# Altium project DCI_MB1137.PrjPCB
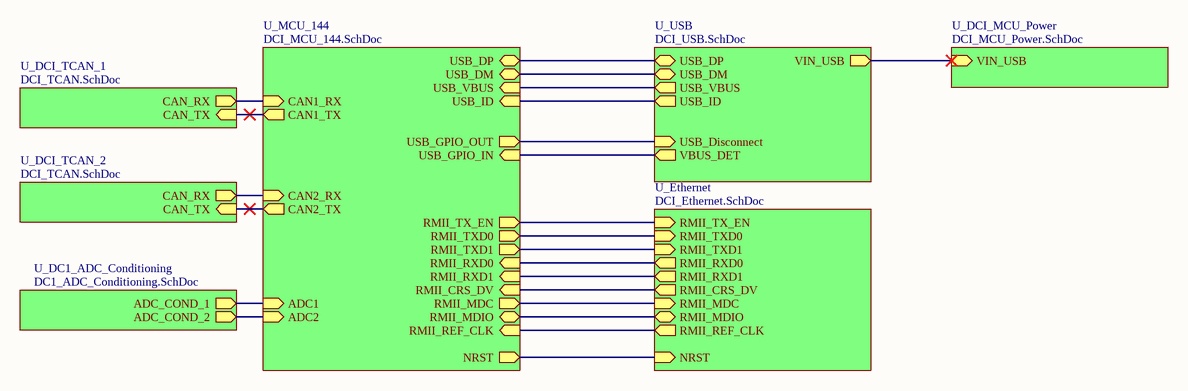
[diagram p0: DCI_MB1137.SchDoc]
7 sheets, 155 parts. Net scope: hierarchical (ports join the sheet entries above them; power ports are global).
Board file: DCI_MB1137.PcbDoc
Sheets:
  DCI_MB1137.SchDoc
    U_Ethernet = DCI_Ethernet.SchDoc
    U_MCU_144 = DCI_MCU_144.SchDoc
    U_USB = DCI_USB.SchDoc
    U_DCI_TCAN_2 = DCI_TCAN.SchDoc
    U_DC1_ADC_Conditioning = DC1_ADC_Conditioning.SchDoc
    U_DCI_MCU_Power = DCI_MCU_Power.SchDoc
    U_DCI_TCAN_1 = DCI_TCAN.SchDoc

## Sheet DCI_MB1137.SchDoc
size 420 x 297 mm; ENG_APP_DATE: --/--/--; DSN_APP_DATE: --/--/--; CHK_APP_DATE: --/--/--

### Sub-sheets
U_DC1_ADC_Conditioning = DC1_ADC_Conditioning.SchDoc: ADC_COND_1 (out), ADC_COND_2 (out)
U_DCI_MCU_Power = DCI_MCU_Power.SchDoc: VIN_USB (in)
U_DCI_TCAN_1 = DCI_TCAN.SchDoc: CAN_TX (in), CAN_RX (out)
U_DCI_TCAN_2 = DCI_TCAN.SchDoc: CAN_TX (in), CAN_RX (out)
U_Ethernet = DCI_Ethernet.SchDoc: RMII_TXD0 (in), RMII_TX_EN (in), RMII_RXD0 (out), RMII_REF_CLK (out), RMII_CRS_DV (out), RMII_MDC (in), RMII_MDIO (bidir), NRST (in), RMII_TXD1 (in), RMII_RXD1 (out)
U_MCU_144 = DCI_MCU_144.SchDoc: NRST (out), USB_DM (bidir), USB_DP (bidir), USB_GPIO_OUT (out), USB_GPIO_IN (in), USB_ID (in), USB_VBUS (in), RMII_TXD0 (out), RMII_TX_EN (out), RMII_RXD0 (in), RMII_REF_CLK (in), RMII_CRS_DV (in), RMII_MDC (out), RMII_MDIO (bidir), RMII_TXD1 (out), RMII_RXD1 (in), ADC1 (in), ADC2 (in), CAN1_RX (in), CAN1_TX (out), CAN2_TX (out), CAN2_RX (in)
U_USB = DCI_USB.SchDoc: USB_DM (bidir), USB_DP (bidir), USB_ID (out), USB_VBUS (out), USB_Disconnect (in), VBUS_DET (out), VIN_USB (out)

### Nets
NRST: sheet U_Ethernet/NRST, sheet U_MCU_144/NRST
PA1: sheet U_Ethernet/RMII_REF_CLK, sheet U_MCU_144/RMII_REF_CLK
PA2: sheet U_Ethernet/RMII_MDIO, sheet U_MCU_144/RMII_MDIO
PA7: sheet U_Ethernet/RMII_CRS_DV, sheet U_MCU_144/RMII_CRS_DV
PA10: sheet U_MCU_144/USB_ID, sheet U_USB/USB_ID
PB13: sheet U_Ethernet/RMII_TXD1, sheet U_MCU_144/RMII_TXD1
PC1: sheet U_Ethernet/RMII_MDC, sheet U_MCU_144/RMII_MDC
PC4: sheet U_Ethernet/RMII_RXD0, sheet U_MCU_144/RMII_RXD0
PC5: sheet U_Ethernet/RMII_RXD1, sheet U_MCU_144/RMII_RXD1
PC12: sheet U_MCU_144/CAN2_TX, sheet U_DCI_TCAN_2/CAN_TX
PD2: sheet U_MCU_144/CAN2_RX, sheet U_DCI_TCAN_2/CAN_RX
PF4: sheet U_MCU_144/ADC1, sheet U_DC1_ADC_Conditioning/ADC_COND_1
PF5: sheet U_MCU_144/ADC2, sheet U_DC1_ADC_Conditioning/ADC_COND_2
PF6: sheet U_MCU_144/CAN1_RX, sheet U_DCI_TCAN_1/CAN_RX
PF7: sheet U_MCU_144/CAN1_TX, sheet U_DCI_TCAN_1/CAN_TX
PG6: sheet U_MCU_144/USB_GPIO_OUT, sheet U_USB/USB_Disconnect
PG7: sheet U_MCU_144/USB_GPIO_IN, sheet U_USB/VBUS_DET
PG11: sheet U_Ethernet/RMII_TX_EN, sheet U_MCU_144/RMII_TX_EN
PG13: sheet U_Ethernet/RMII_TXD0, sheet U_MCU_144/RMII_TXD0
USB_D_N: sheet U_MCU_144/USB_DM, sheet U_USB/USB_DM
USB_D_P: sheet U_MCU_144/USB_DP, sheet U_USB/USB_DP
VIN_USB: sheet U_MCU_144/USB_VBUS, sheet U_USB/USB_VBUS, sheet U_USB/VIN_USB, sheet U_DCI_MCU_Power/VIN_USB

### Notes on the sheet
- MEMBERS:
- Universitat Politècnica de València
- - Gianmarco Leopoldo Sangoi
- - Vicente Beltrán Morte
- PROJECT:
- SIZE:
- FILE NAME:
- A3
- NUMBER:
- 1
- REVISION:
- A1
- DATE:
- 07/05/2022
- SHEET
- OF
- 7

## Sheet DCI_Ethernet.SchDoc
size 420 x 297 mm; ENG_APP_DATE: --/--/--; DSN_APP_DATE: --/--/--; CHK_APP_DATE: --/--/--
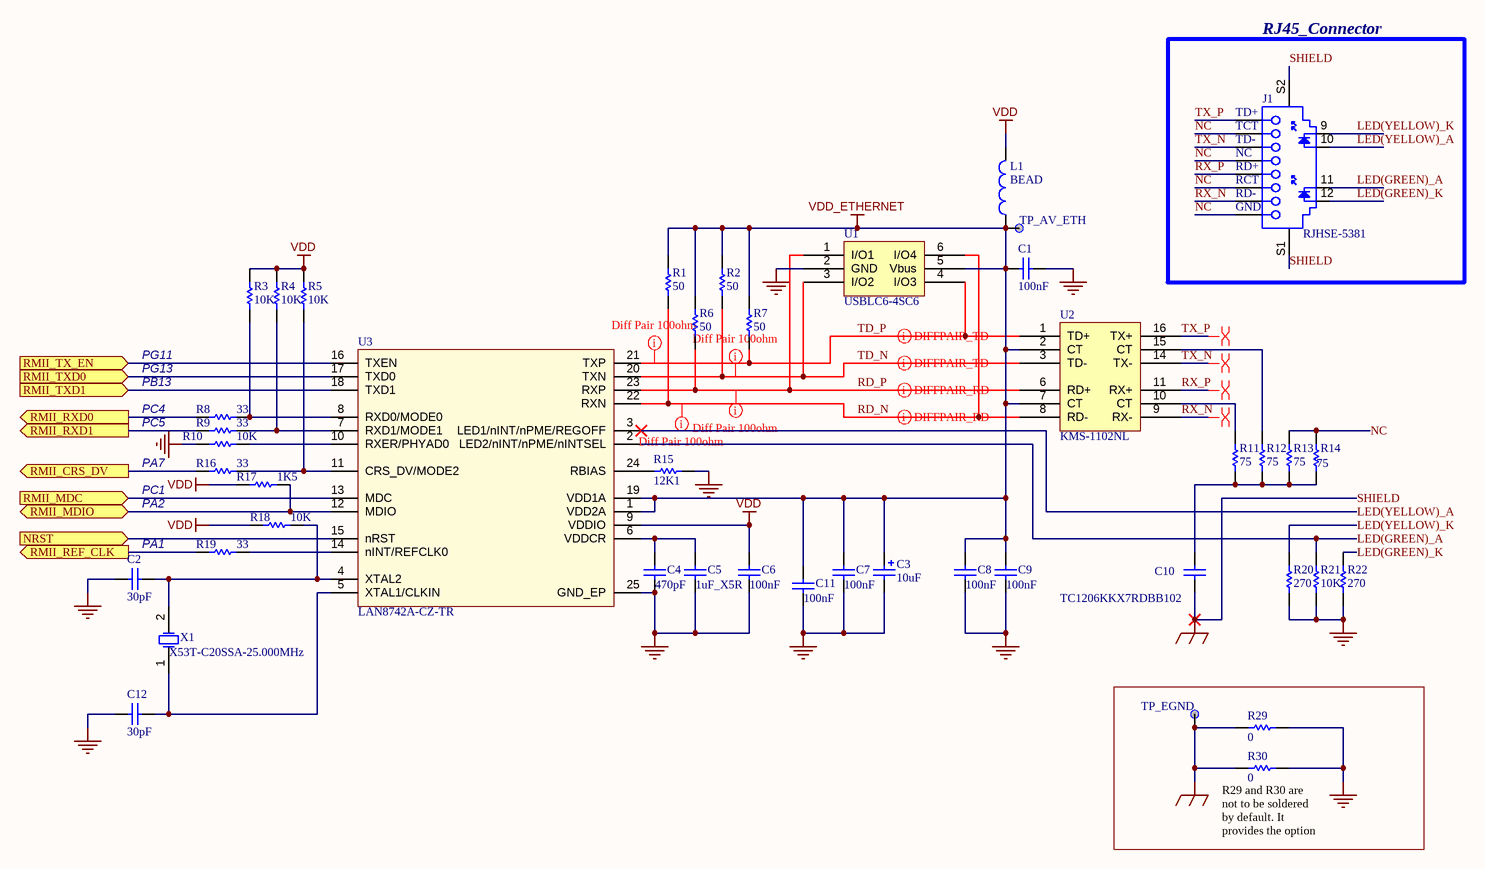
[diagram p1: DCI_Ethernet.SchDoc]

### Parts
C1  100nF  [0603C]
C2  30pF  [0603C]
C3  10uF  [TAN-A - XDown]
C4  470pF  [0603C]
C5  1uF_X5R  [0603C]
C6  100nF  [0603C]
C7  100nF  [0603C]
C8  100nF  [0603C]
C9  100nF  [0603C]
C10  TC1206KKX7RDBB102  [1206C]
C11  100nF  [0603C]
C12  30pF  [0603C]
J1  RJHSE-5381  [AMPH-RJHSE-5381_V]
L1  BEAD  [0603L]
R1  50  [0603R]
R2  50  [0603R]
R3  10K  [0603R]
R4  10K  [0603R]
R5  10K  [0603R]
R6  50  [0603R]
R7  50  [0603R]
R8  33  [0603R]
R9  33  [0603R]
R10  10K  [0603R]
R11  75  [0603R]
R12  75  [0603R]
R13  75  [0603R]
R14  75  [0603R]
R15  12K1  [0603R]
R16  33  [0603R]
R17  1K5  [0603R]
R18  10K  [0603R]
R19  33  [0603R]
R20  270  [0603R]
R21  10K  [0603R]
R22  270  [0603R]
R29  0  [0603R]
R30  0  [0603R]
TP_AV_ETH  TP_AVDD_ETH  [TP]  (value not drawn)
TP_EGND  TP_EGND  [TP]  (value not drawn)
U1  USBLC6-4SC6  [SOT23-6L]
U2  KMS-1102NL  [Transformer]
U3  LAN8742A-CZ-TR  [QFN24_0R5_4X4]
X1  X53T-C20SSA-25.000MHz  [XTAL_2SM_5R0X3R2]

### Blocks framed on the sheet
RJ45_Connector: J1

### Ports
NRST (in), RMII_CRS_DV (out), RMII_MDC (in), RMII_MDIO (bidir), RMII_REF_CLK (out), RMII_RXD0 (out), RMII_RXD1 (out), RMII_TX_EN (in), RMII_TXD0 (in), RMII_TXD1 (in)

### Nets
GND: C1.1 C2.2 C3.2 C4.1 C5.2 C6.1 C7.1 C8.1 C9.1 C11.1 C12.2 R10.2 R15.2 R20.2 R21.2 R22.2 R29.1 R30.1 U1.2(GND) U3.25(GND_EP)
SHIELD: C10.1 J1.S1 J1.S2 R29.2 R30.2 TP_EGND.1  [also labelled EGND]
VDD: C6.2 L1.2 R3.1 R4.1 R5.1 R17.2 R18.1 U3.9(VDDIO)
VDD_ETHERNET: C1.2 C3.1 C7.2 C8.2 C9.2 C11.2 L1.1 R1.2 R2.2 R6.2 R7.2 TP_AV_ETH.1 U1.5(Vbus) U2.2(CT) U2.7(CT) U3.1(VDD2A) U3.19(VDD1A)
LED(GREEN)_A: J1.11 R21.1 U3.2(LED2/nINT/nPME/nINTSEL)
LED(GREEN)_K: J1.12 R22.1
LED(YELLOW)_A: J1.10 U3.3(LED1/nINT/nPME/REGOFF)
LED(YELLOW)_K: J1.9 R20.1
NC: J1.2(TCT) J1.4(NC) J1.6(RCT) J1.8(GND) R13.2 R14.2
NRST: U3.15(nRST) ; port NRST
PA1: R19.2 ; port RMII_REF_CLK
PA2: R17.1 U3.12(MDIO) ; port RMII_MDIO
PA7: R16.2 ; port RMII_CRS_DV
PB13: U3.18(TXD1) ; port RMII_TXD1
PC1: U3.13(MDC) ; port RMII_MDC
PC4: R8.2 ; port RMII_RXD0
PC5: R9.2 ; port RMII_RXD1
PG11: U3.16(TXEN) ; port RMII_TX_EN
PG13: U3.17(TXD0) ; port RMII_TXD0
RD_N: R1.1 U1.6(I/O4) U2.8(RD-) U3.22(RXN)
RD_P: R6.1 U1.1(I/O1) U2.6(RD+) U3.23(RXP)
RX_N: J1.7(RD-) U2.9(RX-)
RX_P: J1.5(RD+) U2.11(RX+)
TD_N: R2.1 U1.3(I/O2) U2.3(TD-) U3.20(TXN)
TD_P: R7.1 U1.4(I/O3) U2.1(TD+) U3.21(TXP)
TX_N: J1.3(TD-) U2.14(TX-)
TX_P: J1.1(TD+) U2.16(TX+)
NetC2_1: C2.1 R18.2 U3.4(XTAL2) X1.2(OSC2)
NetC4_2: C4.2 C5.1 U3.6(VDDCR)
NetC10_2: C10.2 R11.1 R12.1 R13.1 R14.1
NetC12_1: C12.1 U3.5(XTAL1/CLKIN) X1.1(OSC1)
NetR3_2: R3.2 R8.1 U3.8(RXD0/MODE0)
NetR4_2: R4.2 R9.1 U3.7(RXD1/MODE1)
NetR5_2: R5.2 R16.1 U3.11(CRS_DV/MODE2)
NetR10_1: R10.1 U3.10(RXER/PHYAD0)
NetR11_2: R11.2 U2.10(CT)
NetR12_2: R12.2 U2.15(CT)
NetR15_1: R15.1 U3.24(RBIAS)
NetR19_1: R19.1 U3.14(nINT/REFCLK0)

### Layout directives
differential pair: RD_N, RD_P, RX_N, RX_P, TD_N, TD_P, TX_N, TX_P
rule Matched Net Lengths [Tolerance = 100mil]: RD_N, RD_P, TD_N, TD_P

### Notes on the sheet
- PG11
- PG13
- PB13
- PC4
- PC5
- PA7
- PC1
- PA2
- (near C2) PA1
- (near R30) R29 and R30 are not to be soldered by default. It provides the option of it being present to the final user. Therefore, only the footprint will be present in the final assembly
- MEMBERS:
- Universitat Politècnica de València
- - Gianmarco Leopoldo Sangoi
- - Vicente Beltrán Morte
- PROJECT:
- SIZE:
- FILE NAME:
- A3
- NUMBER:
- 4
- REVISION:
- A1
- DATE:
- 07/05/2022
- SHEET
- OF
- 7

### Library data of the parts
C1 C6-C9 C11 = Capacitor_ST: Capacitor 0402 / 0603 / 0805; Revision: July-2002: Re-released for DXP Platform.; Value: 100nF
C2 C4 C12 = Capacitor_ST: Capacitor 0402 / 0603 / 0805; Value: 100nF; Revision: July-2002: Re-released for DXP Platform.
C3 = Cap_10uF_POL_10%_TANA: Polarized Capacitor,10uF,10V,10%,typeA,VISHAY; Manuf_Part_1: 293D106X9010A2TE3; Revision: July-2002: Re-released for DXP Platform.; Value: 10uF; Manuf_1: VISHAY; Order: *; ECCN_US/EU: n/a
C5 = CAP SMD 0603  X5R 1µF 25V 10%: 0603  X5R 1µF; Rated voltage: 25V; Tolerance: 10%; Manufacturer: *; Manufacturer P/N: *; Order code Farnell: 1288202RL; Value: 1µF; Power: *; Technology: X5R; Temperature  Factor: *; Temperature Max: +125°C; Temperature Min: -55°C; STS Code: *
C10 = Capacitor_ST: Capacitor 0402 / 0603 / 0805/ 1206; Value: 100nF; Revision: July-2002: Re-released for DXP Platform.
J1 = CMP-2000-06980-1: High Speed RJ45, Modular Jack, 8 Position, 8 Contacts, Shielded, with LEDs, -55 to 85 degC,12-Pin THD, RoHS, Tray; Manufacturer: Amphenol; Number of Positions/Contacts: 8p8c(RJ45,Ethernet); Number of Ports: 1; Catalog Drawings: RJ45SeriesRightAngle; PCN Design/Specification: MultipleSeriesCopper29/Jan/2009RJHSEShieldMaterial30/Jun/2015; Other Names: RJHSE5381; Online Catalog: RJHSESeries; Featured Product: ModularJacksProductSolutions; Tab Direction: Up; Shielding: Shielded,EMIFinger; LED Color: Yellow-Green; 3D Model: RJHSE538x.stpRJHSE538x.igs; Category: Connectors,Interconnects; Termination: Solder; Housing Material: Thermoplastic; Mounting Type: ThroughHole; Family: ModularConnectors-Jacks; Orientation: 90°Angle(Right); Features: BoardLock; Contact Material: PhosphorBronze; Mounting Technology: ThroughHole; Number of Rows: 1; Standard Package: 120; Ratings: -; Operating Temperature: -55°C~85°C; Series: RJHSE; Contact Finish: Gold; Package Reference: RJHSE-5381; Ingress Protection: -; Package Description: 12-Pin Through Hole Device, Body 16.51 x 15.75 mm; Contact Finish Thickness: 50µin(1.27µm); Datasheet URL: https://datasheet.ciiva.com/16481/rjhse538x-16481714.pdf; Datasheet Version: Rev. K, 04/2014; Connector Type: Jack; Manufacturer URL: http://www.amphenol.com/; Packaging: Tray
L1 = Inductor: Value: 100uH; Published: 8-Jun-2000; Revision: July-2002: Re-released for DXP Platform.; Publisher: Altium Limited
R1 R2 R6 R7 = Res_50_1%_0603: Resistor,50,0603,1%,YAGEO; Manuf_Part_1: RC0402FR-0750RL; Value: 50; Manuf_1: YAGEO; Order: *; ECCN_US/EU: n/a; Distrib: FARNELL
R3-R5 R10 R18 R21 = Resistor_ST: Resistor 0402 / 0603 / 0805; Value: 10K
R8 R9 R16 R19 = Res_33_1%_0402: Resistor,33,0402,1%,YAGEO; Manuf_Part_1: RC0402FR-0733RL; Value: 33; Manuf_1: YAGEO; Order: *; ECCN_US/EU: n/a; Distrib: FARNELL
R11-R14 = Res_75_1%_0603: Resistor,75,0603,1%,YAGEO; Manuf_Part_1: RC0402FR-0750RL; Value: 50; Manuf_1: YAGEO; Order: *; ECCN_US/EU: n/a; Distrib: FARNELL
R15 = Res_12K1_1%_0603: Resistor,12K1,0603,1%,VISHAY; Manuf_Part_1: MCT 0603-50 1% P5 12K1; Order: 2325243; Value: 12K1; ECCN_US/EU: n/a; Manuf_1: VISHAY; Distrib: FARNELL
R17 = Res_1K5_1%_0402: Resistor,1K5,0402,1%,YAGEO; Manuf_Part_1: RC0402FR-071K5L; Value: 1K5; Manuf_1: YAGEO; Order: RC0402FR-071K5L; ECCN_US/EU: n/a; Distrib: FARNELL
R20 R22 = Resistor_ST: Resistor 0402 / 0603 / 0805; Value: 10K
R29 R30 = Res1: Resistor; Value: 1K; Ordered by: Subcon; Published: 8-Jun-2000; Revision: July-2002: Re-released for DXP Platform.; Publisher: Altium Limited
TP_AV_ETH TP_EGND = TP
U3 = LAN8742A-CZ-TR: LAN8742A-CZ-TR - Small Footprint RMII 10/100 Ethernet, Transceiver with HP Auto-MDIX and flexPWR Technology SQFN-24; Manuf_1: MICROCHIP; Order: LAN8742A-CZ-TR; Manuf_Part_1: LAN8742A-CZ-TR; Distrib: MICROCHIP
X1 = XTAL_5032: Crystal Oscillator; Published: 8-Jun-2000; LatestRevisionDate: 17-Jul-2002; LatestRevisionNote: Re-released for DXP Platform.; PackageReference: R38; Publisher: Altium Limited

## Sheet DCI_MCU_144.SchDoc
size 420 x 297 mm; Project: NUCLEO-XXXXZX
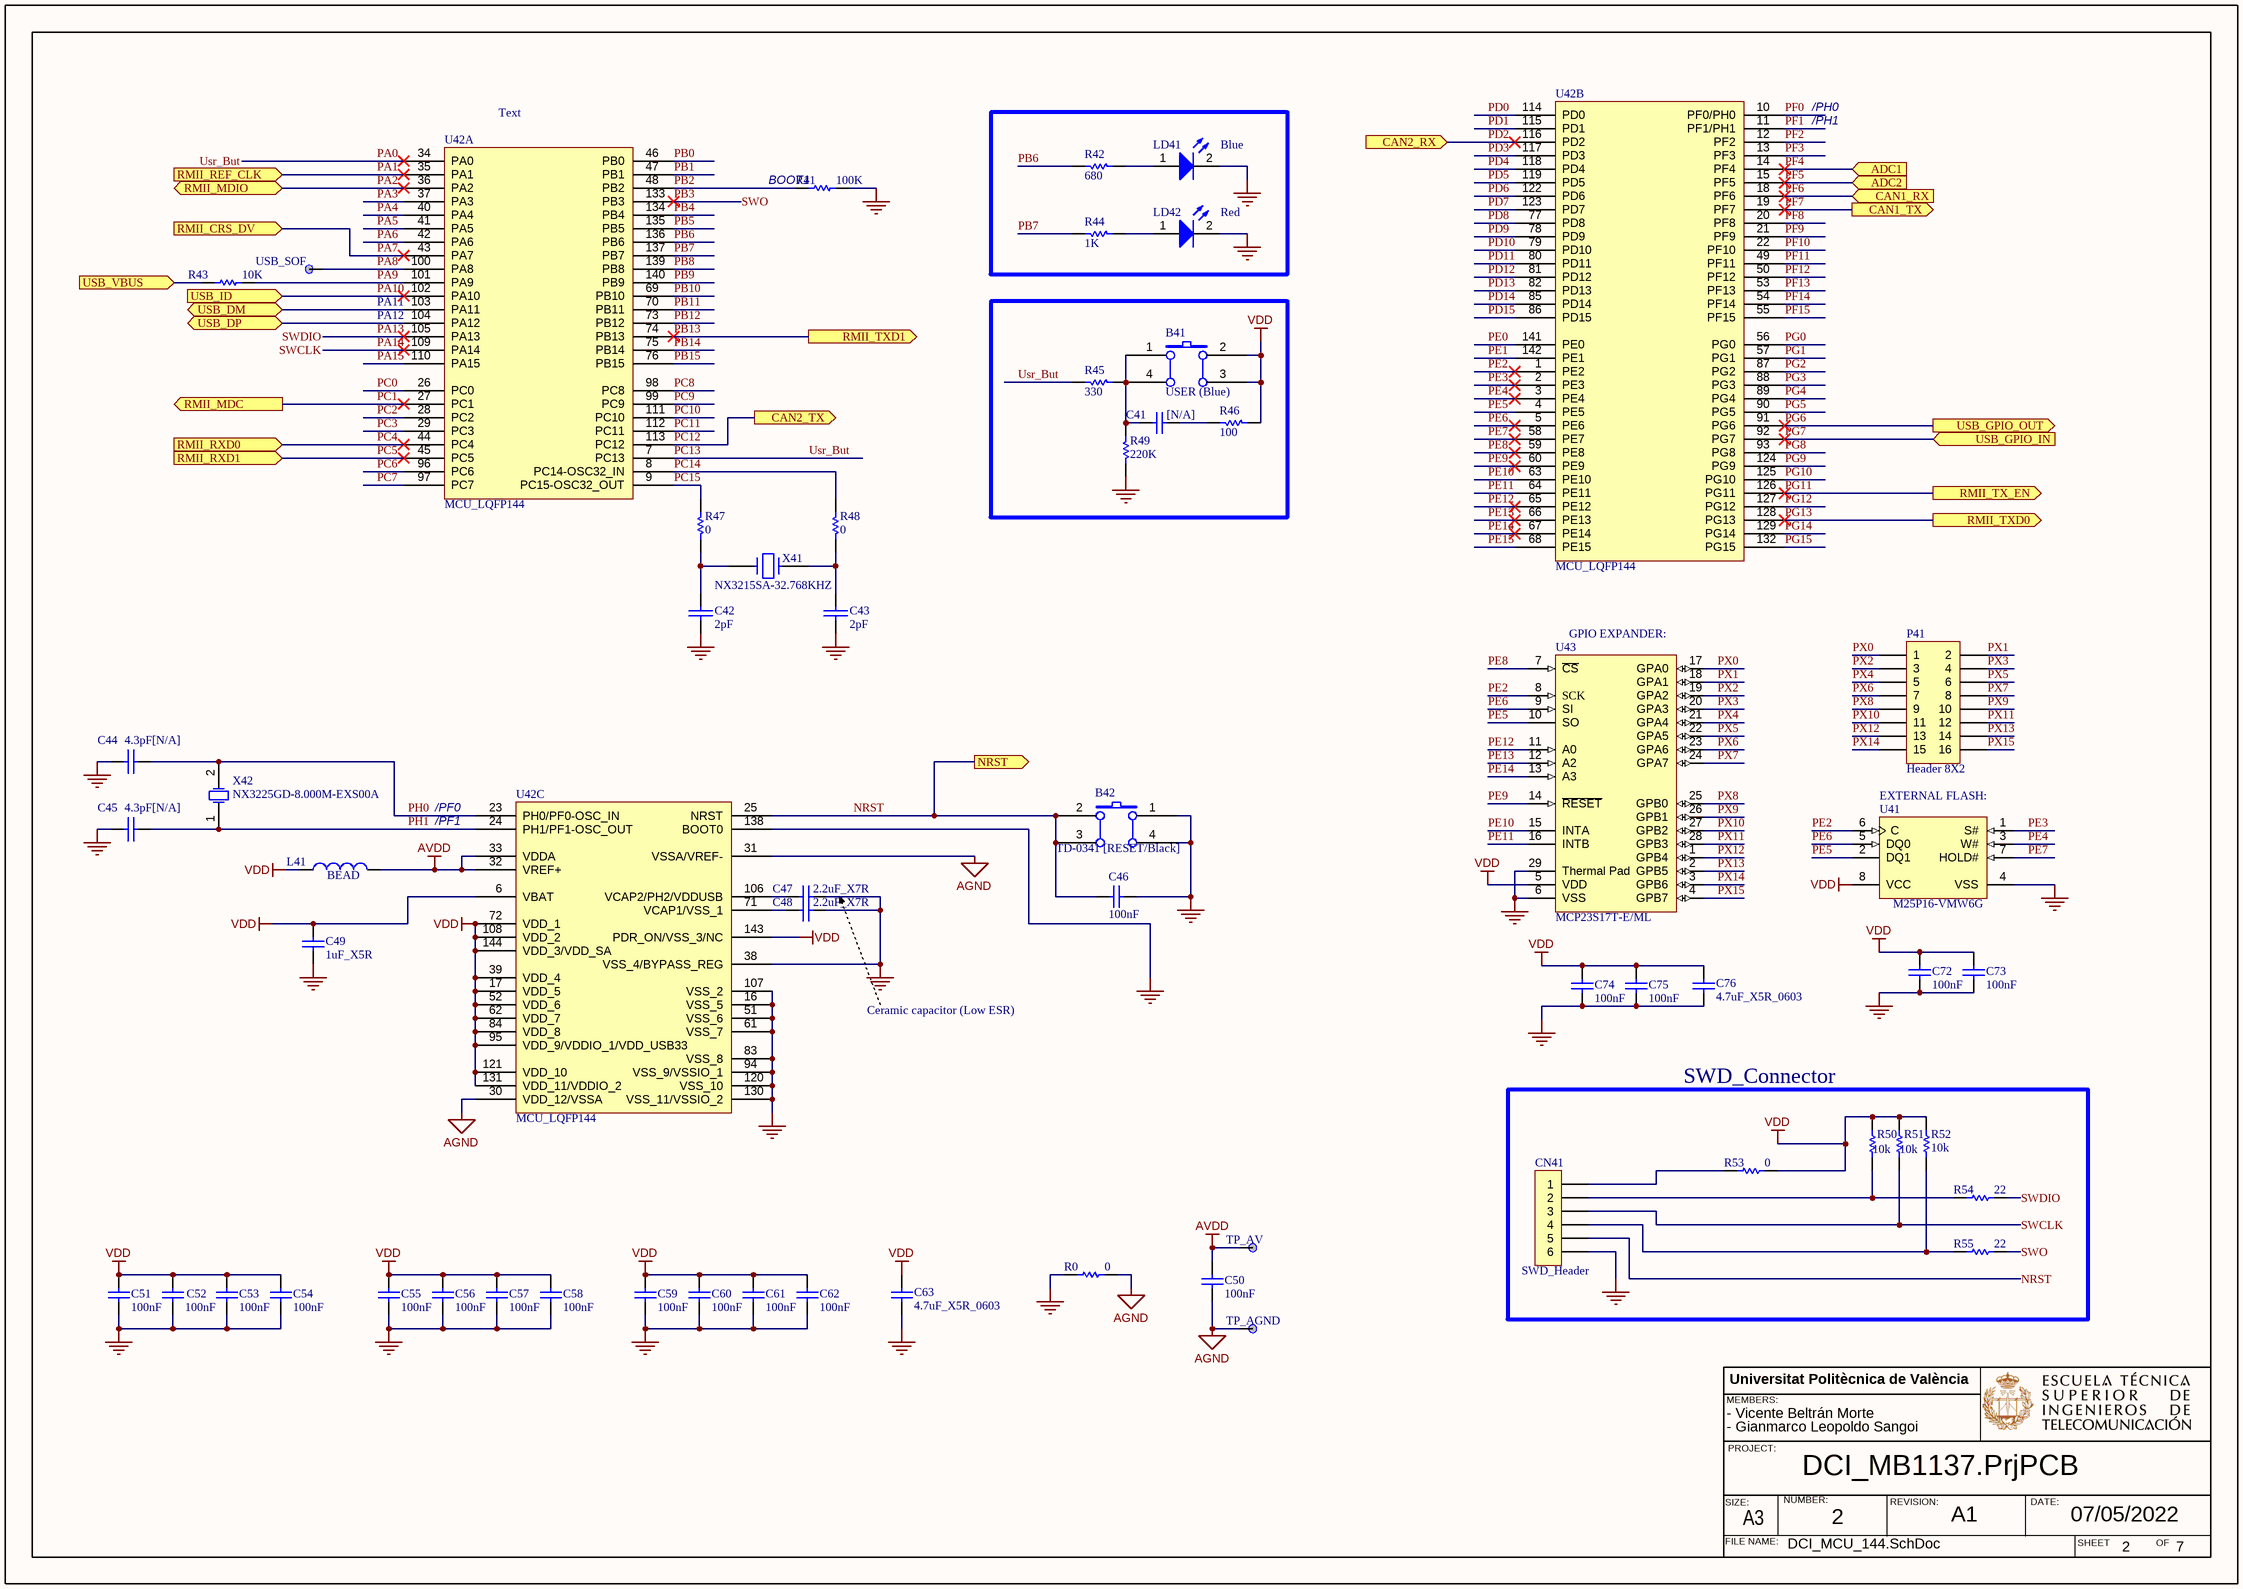
[diagram p2: DCI_MCU_144.SchDoc]

### Parts
B41  USER (Blue)  [PB-6X6mm-Blue]
B42  TD-0341 [RESET/Black]  [PB-6X6mm-Black]
C41  [N/A]  [0603C]
C42  2pF  [0603C]
C43  2pF  [0603C]
C44  4.3pF[N/A]  [0603C]
C45  4.3pF[N/A]  [0603C]
C46  100nF  [0603C]
C47  2.2uF_X7R  [TAN-A - XDown]
C48  2.2uF_X7R  [TAN-A - XUp]
C49  1uF_X5R  [0603C]
C50  100nF  [0603C]
C51  100nF  [0603C]
C52  100nF  [0603C]
C53  100nF  [0603C]
C54  100nF  [0603C]
C55  100nF  [0603C]
C56  100nF  [0603C]
C57  100nF  [0603C]
C58  100nF  [0603C]
C59  100nF  [0603C]
C60  100nF  [0603C]
C61  100nF  [0603C]
C62  100nF  [0603C]
C63  4.7uF_X5R_0603  [0603C]
C72  100nF  [0603C]
C73  100nF  [0603C]
C74  100nF  [0603C]
C75  100nF  [0603C]
C76  4.7uF_X5R_0603  [0603C]
CN41  SWD_Header  [HDR_1x6_2R54_V_M]
L41  BEAD  [0603L]
LD41  Blue  [0603D-B]
LD42  Red  [0603D-R]
P41  Header 8X2  [HDR2X8]
R0  0  [0603R]
R41  100K  [0603R]
R42  680  [0603R]
R43  10K  [0603R]
R44  1K  [0603R]
R45  330  [0603R]
R46  100  [0603R]
R47  0  [0603R]
R48  0  [0603R]
R49  220K  [0603R]
R50  10k  [0603R]
R51  10k  [0603R]
R52  10k  [0603R]
R53  0  [0603R]
R54  22  [0603R]
R55  22  [0603R]
TP_AGND  TP_AGND  [TP]  (value not drawn)
TP_AV  TP_AVDD  [TP]  (value not drawn)
U41  M25P16-VMW6G  [MICT-MW-8_N]
U42  MCU_LQFP144  [TSQFP50P2200X2200X160-144N]  (parts A,B,C of 3)
U43  MCP23S17T-E/ML  [QFN-ML28_L-Improved_Holes]
USB_SOF  USB_SOF  [TP]  (value not drawn)
X41  NX3215SA-32.768KHZ  [XTAL_2SM_3R2X1R5]
X42  NX3225GD-8.000M-EXS00A  [OSC_2SM_3R2x2R5]

### Blocks framed on the sheet
SWD_Connector: CN41 R50-R55

### Ports
ADC1 (in), ADC2 (in), CAN1_RX (in), CAN1_TX (out), CAN2_RX (in), CAN2_TX (out), NRST (out), RMII_CRS_DV (in), RMII_MDC (out), RMII_MDIO (bidir), RMII_REF_CLK (in), RMII_RXD0 (in), RMII_RXD1 (in), RMII_TX_EN (out), RMII_TXD0 (out), RMII_TXD1 (out), USB_DM (bidir), USB_DP (bidir), USB_GPIO_IN (in), USB_GPIO_OUT (out), USB_ID (in), USB_VBUS (in)

### Nets
AGND: C50.2 R0.2 TP_AGND.1 U42.30(VDD_12/VSSA) U42.31(VSSA/VREF-)
AVDD: C50.1 L41.2 TP_AV.1 U42.32(VREF+) U42.33(VDDA)
GND: B42.1(A0) B42.4(A1) C42.2 C43.2 C44.2 C45.2 C46.1 C47.2 C48.2 C49.2 C51.2 C52.2 C53.2 C54.2 C55.2 C56.2 C57.2 C58.2 C59.2 C60.2 C61.2 C62.2 C63.2 C72.2 C73.2 C74.2 C75.2 C76.2 CN41.6 LD41.2(K) LD42.2(K) R0.1 R41.2 R49.2 U41.4(VSS) U42.16(VSS_5) U42.38(VSS_4/BYPASS_REG) U42.51(VSS_6) U42.61(VSS_7) U42.83(VSS_8) U42.94(VSS_9/VSSIO_1) U42.107(VSS_2) U42.120(VSS_10) U42.130(VSS_11/VSSIO_2) U42.138(BOOT0) U43.6(VSS) U43.29(Thermal_Pad)
VDD: B41.2(B0) B41.3(B1) C49.1 C51.1 C52.1 C53.1 C54.1 C55.1 C56.1 C57.1 C58.1 C59.1 C60.1 C61.1 C62.1 C63.1 C72.1 C73.1 C74.1 C75.1 C76.1 L41.1 R46.1 R50.2 R51.2 R52.2 R53.1 U41.8(VCC) U42.6(VBAT) U42.17(VDD_5) U42.39(VDD_4) U42.52(VDD_6) U42.62(VDD_7) U42.72(VDD_1) U42.84(VDD_8) U42.95(VDD_9/VDDIO_1/VDD_USB33) U42.108(VDD_2) U42.121(VDD_10) U42.131(VDD_11/VDDIO_2) U42.143(PDR_ON/VSS_3/NC) U42.144(VDD_3/VDD_SA) U43.5(VDD)
NRST: B42.2(B0) B42.3(B1) C46.2 CN41.5 U42.25(NRST) ; port NRST
PA0: R45.2 U42.7(PC13) U42.34(PA0)  [also labelled PC13, Usr_But]
PA1: U42.35(PA1) ; port RMII_REF_CLK
PA2: U42.36(PA2) ; port RMII_MDIO
PA3: U42.37(PA3)
PA4: U42.40(PA4)
PA5: U42.41(PA5)
PA6: U42.42(PA6)
PA7: U42.43(PA7) ; port RMII_CRS_DV
PA8: U42.100(PA8) USB_SOF.1
PA9: R43.2 U42.101(PA9)
PA10: U42.102(PA10) ; port USB_ID
PA13: R54.2 U42.105(PA13)  [also labelled SWDIO]
PA14: CN41.3 R51.1 U42.109(PA14)  [also labelled SWCLK]
PA15: U42.110(PA15)
PB0: U42.46(PB0)
PB1: U42.47(PB1)
PB2: R41.1 U42.48(PB2)
PB3: R55.2 U42.133(PB3)  [also labelled SWO]
PB4: U42.134(PB4)
PB5: U42.135(PB5)
PB6: R42.1 U42.136(PB6)
PB7: R44.1 U42.137(PB7)
PB8: U42.139(PB8)
PB9: U42.140(PB9)
PB10: U42.69(PB10)
PB11: U42.70(PB11)
PB12: U42.73(PB12)
PB13: U42.74(PB13) ; port RMII_TXD1
PB14: U42.75(PB14)
PB15: U42.76(PB15)
PC0: U42.26(PC0)
PC1: U42.27(PC1) ; port RMII_MDC
PC2: U42.28(PC2)
PC3: U42.29(PC3)
PC4: U42.44(PC4) ; port RMII_RXD0
PC5: U42.45(PC5) ; port RMII_RXD1
PC6: U42.96(PC6)
PC7: U42.97(PC7)
PC8: U42.98(PC8)
PC9: U42.99(PC9)
PC10: U42.111(PC10)
PC11: U42.112(PC11)
PC12: U42.113(PC12) ; port CAN2_TX
PC14: R48.2 U42.8(PC14-OSC32_IN)
PC15: R47.2 U42.9(PC15-OSC32_OUT)
PD0: U42.114(PD0)
PD1: U42.115(PD1)
PD2: U42.116(PD2) ; port CAN2_RX
PD3: U42.117(PD3)
PD4: U42.118(PD4)
PD5: U42.119(PD5)
PD6: U42.122(PD6)
PD7: U42.123(PD7)
PD8: U42.77(PD8)
PD9: U42.78(PD9)
PD10: U42.79(PD10)
PD11: U42.80(PD11)
PD12: U42.81(PD12)
PD13: U42.82(PD13)
PD14: U42.85(PD14)
PD15: U42.86(PD15)
PE0: U42.141(PE0)
PE1: U42.142(PE1)
PE2: U41.6(C) U42.1(PE2) U43.8(SCK)
PE3: U41.1(S#) U42.2(PE3)
PE4: U41.3(W#) U42.3(PE4)
PE5: U41.2(DQ1) U42.4(PE5) U43.10(SO)
PE6: U41.5(DQ0) U42.5(PE6) U43.9(SI)
PE7: U41.7(HOLD#) U42.58(PE7)
PE8: U42.59(PE8) U43.7(~{CS})
PE9: U42.60(PE9) U43.14(~{RESET})
PE10: U42.63(PE10) U43.15(INTA)
PE11: U42.64(PE11) U43.16(INTB)
PE12: U42.65(PE12) U43.11(A0)
PE13: U42.66(PE13) U43.12(A2)
PE14: U42.67(PE14) U43.13(A3)
PE15: U42.68(PE15)
PF0: U42.10(PF0/PH0)
PF1: U42.11(PF1/PH1)
PF2: U42.12(PF2)
PF3: U42.13(PF3)
PF4: U42.14(PF4) ; port ADC1
PF5: U42.15(PF5) ; port ADC2
PF6: U42.18(PF6) ; port CAN1_RX
PF7: U42.19(PF7) ; port CAN1_TX
PF8: U42.20(PF8)
PF9: U42.21(PF9)
PF10: U42.22(PF10)
PF11: U42.49(PF11)
PF12: U42.50(PF12)
PF13: U42.53(PF13)
PF14: U42.54(PF14)
PF15: U42.55(PF15)
PG0: U42.56(PG0)
PG1: U42.57(PG1)
PG2: U42.87(PG2)
PG3: U42.88(PG3)
PG4: U42.89(PG4)
PG5: U42.90(PG5)
PG6: U42.91(PG6) ; port USB_GPIO_OUT
PG7: U42.92(PG7) ; port USB_GPIO_IN
PG8: U42.93(PG8)
PG9: U42.124(PG9)
PG10: U42.125(PG10)
PG11: U42.126(PG11) ; port RMII_TX_EN
PG12: U42.127(PG12)
PG13: U42.128(PG13) ; port RMII_TXD0
PG14: U42.129(PG14)
PG15: U42.132(PG15)
PH0: C44.1 U42.23(PH0/PF0-OSC_IN) X42.2(OSC2)
PH1: C45.1 U42.24(PH1/PF1-OSC_OUT) X42.1(OSC1)
PX0: P41.1 U43.17(GPA0)
PX1: P41.2 U43.18(GPA1)
PX2: P41.3 U43.19(GPA2)
PX3: P41.4 U43.20(GPA3)
PX4: P41.5 U43.21(GPA4)
PX5: P41.6 U43.22(GPA5)
PX6: P41.7 U43.23(GPA6)
PX7: P41.8 U43.24(GPA7)
PX8: P41.9 U43.25(GPB0)
PX9: P41.10 U43.26(GPB1)
PX10: P41.11 U43.27(GPB2)
PX11: P41.12 U43.28(GPB3)
PX12: P41.13 U43.1(GPB4)
PX13: P41.14 U43.2(GPB5)
PX14: P41.15 U43.3(GPB6)
PX15: P41.16 U43.4(GPB7)
USB_D_N: U42.103(PA11) ; port USB_DM
USB_D_P: U42.104(PA12) ; port USB_DP
VIN_USB: R43.1 ; port USB_VBUS
NetB41_1: B41.1(A0) B41.4(A1) C41.2 R45.1 R49.1
NetC41_1: C41.1 R46.2
NetC42_1: C42.1 R47.1 X41.1
NetC43_1: C43.1 R48.1 X41.2
NetC47_1: C47.1 U42.106(VCAP2/PH2/VDDUSB)
NetC48_1: C48.1 U42.71(VCAP1/VSS_1)
NetCN41_1: CN41.1 R53.2
NetCN41_2: CN41.2 R50.1 R54.1
NetCN41_4: CN41.4 R52.1 R55.1
NetLD41_1: LD41.1(A) R42.2
NetLD42_1: LD42.1(A) R44.2

### Notes on the sheet
- (near U42) Text
- /PH0
- /PH1
- (near R41) BOOT1
- (near U42) PA11
- (near U42) PA12
- (near U43) GPIO EXPANDER:
- EXTERNAL FLASH:
- /PF0
- /PF1
- Ceramic capacitor (Low ESR)
- MEMBERS:
- Universitat Politècnica de València
- - Gianmarco Leopoldo Sangoi
- - Vicente Beltrán Morte
- PROJECT:
- SIZE:
- FILE NAME:
- A3
- NUMBER:
- 2
- REVISION:
- A1
- DATE:
- 07/05/2022
- SHEET
- OF
- 7

### Library data of the parts
B41 B42 = SW PUSHBUTTON: SE PUSHBUTTON
C41 C46 = CAP: Capacitor; Value: 100pF; Published: 8-Jun-2000; Revision: July-2002: Re-released for DXP Platform.; Publisher: Altium Limited
C42-C45 = CAP: Capacitor
C47 C48 = Cap_2.2uF_X7R_10%_0805: Capacitor,2.2uF,16V, X7R,10%,0805,YAGEO; Manuf_Part_1: CC0805KKX7R7BB225; Revision: July-2002: Re-released for DXP Platform.; Value: 2.2uF; Order: CC0805KKX7R7BB225; Manuf_1: YAGEO
C49 = CAP SMD 0603  X5R 1µF 25V 10%: as C5 on sheet DCI_Ethernet; Manufacturer: *; Manufacturer P/N: *; Order code Farnell: 1288202RL; Value: 1µF; Power: *; Technology: X5R; Temperature  Factor: *; Temperature Max: +125°C; Temperature Min: -55°C; STS Code: *
C50-C62 C72-C75 = Cap: Capacitor; Value: 10nF; Published: 8-Jun-2000; Revision: July-2002: Re-released for DXP Platform.; Publisher: Altium Limited
C63 C76 = CAP SMD 0603  X5R 1µF 25V 10%: 0603  X5R 4.7uF; Value: 1µF; Rated voltage: 25V; Tolerance: 10%; Manufacturer: *; Manufacturer P/N: *; Order code Farnell: 1288202RL; Power: *; Technology: X5R; Temperature  Factor: *; Temperature Max: +125°C; Temperature Min: -55°C; STS Code: *
CN41 = Header 6X1: Header, 6-Pin, Single row; LatestRevisionDate: 17-Jul-2002; LatestRevisionNote: Re-released for DXP Platform.; Publisher: Altium Limited
L41 = Inductor: Value: 100uH; Published: 8-Jun-2000; Revision: July-2002: Re-released for DXP Platform.; Publisher: Altium Limited
LD41 LD42 = LED2: Typical RED, GREEN, YELLOW, AMBER GaAs LED; Published: 8-Jun-2000; Revision: July-2002: Re-released for DXP Platform.; Publisher: Altium Limited
P41 = Header 8X2: Header, 8-Pin, Dual row; LatestRevisionDate: 17-Jul-2002; LatestRevisionNote: Re-released for DXP Platform.; Publisher: Altium Limited
R0 R41 R49 = res1: Resistor; Value: 1K; Published: 8-Jun-2000; Revision: July-2002: Re-released for DXP Platform.; Publisher: Altium Limited
R42 R45-R48 = Res1: Resistor; Value: 1K; Published: 8-Jun-2000; Revision: July-2002: Re-released for DXP Platform.; Publisher: Altium Limited
R43 R50-R52 = Resistor_ST: Resistor 0402 / 0603 / 0805; Value: 10K
R44 = Res1: Resistor; Published: 8-Jun-2000; Revision: July-2002: Re-released for DXP Platform.; Publisher: Altium Limited; Value: 1K
R53-R55 = Resistor_ST: Resistor 0402 / 0603 / 0805; Value: 10K
TP_AGND TP_AV USB_SOF = TP
U41 = CMP-0357-00145-1: 16 Mb (x1) Serial NOR Flash Memory, 75 MHz, 2.7 to 3.6 V, 8-pin SO8 Wide (MW), Tube; Manufacturer: Micron; Part Family: M25PÂ; Density: 16MbÂ; Speed: 75 MHzÂ; Voltage: 2.7V-3.6VÂ; Mounting Technology: Surface Mount; PackageVersion: Rev 8; DatasheetVersion: Rev. Y; Type: Data StorageÂ; ComponentLink1URL: http://www.micron.com/; ComponentLink1Description: Manufacturer URL; PartNumber: M25P16-VMW6G; ComponentLink3Description: Package Specification; PackageReference: MICT-MW-8; PackageDescription: 8-Pin SO Wide, 5.62 X 6.05 mm, Pitch 1.27 mm; ComponentLink3URL: http://www.micron.com/~/media/Documents/Products/Data%20Sheet/NOR%20Flash/Serial%20NOR/M25P/M25P16.pdf; ComponentLink2URL: http://www.micron.com/~/media/Documents/Products/Data%20Sheet/NOR%20Flash/Serial%20NOR/M25P/M25P16.pdf; Part Status: ProductionÂ; RoHS: YesÂ; ComponentLink2Description: Datasheet; Applications: EmbeddedÂ; Package: SO8 WideÂ; Width: x1Â
U43 = MCP23S17T-E/ML: 16 output GPIO expander
X41 = CRYSTAL_32K: Crystal
X42 = XTAL: Crystal Oscillator; Published: 8-Jun-2000; LatestRevisionDate: 17-Jul-2002; LatestRevisionNote: Re-released for DXP Platform.; PackageReference: R38; Publisher: Altium Limited

## Sheet DCI_USB.SchDoc
size 420 x 297 mm; ENG_APP_DATE: --/--/--; DSN_APP_DATE: --/--/--; CHK_APP_DATE: --/--/--
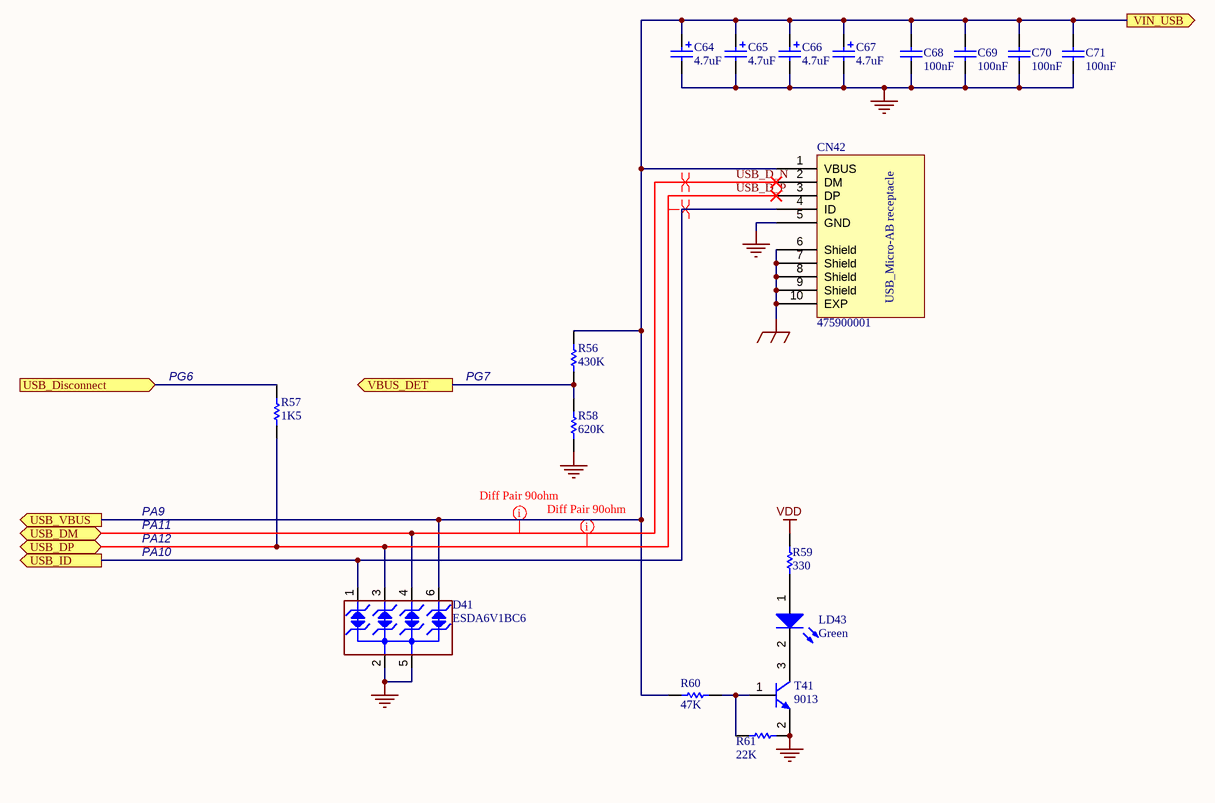
[diagram p3: DCI_USB.SchDoc]

### Parts
C64  4.7uF  [TAN-A - XNo]
C65  4.7uF  [TAN-A - XUp]
C66  4.7uF  [TAN-A - XNo]
C67  4.7uF  [TAN-A - XDown]
C68  100nF  [0603C]
C69  100nF  [0603C]
C70  100nF  [0603C]
C71  100nF  [0603C]
CN42  475900001  [MOLEX_47590001]
D41  ESDA6V1BC6  [SOT23-6L]
LD43  Green  [0603D-G]
R56  430K  [0603R]
R57  1K5  [0603R]
R58  620K  [0603R]
R59  330  [0603R]
R60  47K  [0603R]
R61  22K  [0603R]
T41  9013  [SOT-23]

### Ports
USB_Disconnect (in), USB_DM (bidir), USB_DP (bidir), USB_ID (out), USB_VBUS (out), VBUS_DET (out), VIN_USB (out)

### Nets
EGND: CN42.6(Shield) CN42.7(Shield) CN42.8(Shield) CN42.9(Shield) CN42.10(EXP)  [project net SHIELD]
GND: C64.2 C65.2 C66.2 C67.2 C68.2 C69.2 C70.2 C71.2 CN42.5(GND) D41.2(IO2) D41.5(IO4) R58.2 R61.1 T41.2(E)
VDD: R59.2
PA10: CN42.4(ID) D41.1(IO1) ; port USB_ID
PG6: R57.2 ; port USB_Disconnect
PG7: R56.2 R58.1 ; port VBUS_DET
USB_D_N: CN42.2(DM) D41.4(IO3) ; port USB_DM
USB_D_P: CN42.3(DP) D41.3(GND) R57.1 ; port USB_DP
VIN_USB: C64.1 C65.1 C66.1 C67.1 C68.1 C69.1 C70.1 C71.1 CN42.1(VBUS) D41.6(NC) R56.1 R60.1 ; port USB_VBUS, port VIN_USB
NetLD43_1: LD43.1(A) R59.1
NetLD43_2: LD43.2(K) T41.3(C)
NetR60_2: R60.2 R61.2 T41.1(B)

### Layout directives
mark named Diff Pair 90ohm: USB_D_N, USB_D_P
differential pair: USB_D_N, USB_D_P

### Notes on the sheet
- PG6
- PG7
- PA10
- PA9
- PA12
- PA11
- MEMBERS:
- Universitat Politècnica de València
- - Gianmarco Leopoldo Sangoi
- - Vicente Beltrán Morte
- PROJECT:
- SIZE:
- FILE NAME:
- A3
- NUMBER:
- 3
- REVISION:
- A1
- DATE:
- 07/05/2022
- SHEET
- OF
- 7
- (in symbol 475900001) USB_Micro-AB receptacle

### Library data of the parts
C64-C67 = Cap Pol1: Polarized Capacitor (Radial); Value: 47uF; Published: 8-Jun-2000; Revision: July-2002: Re-released for DXP Platform.; Publisher: Altium Limited
C68-C71 = Cap: Capacitor; Value: 10nF; Published: 8-Jun-2000; Revision: July-2002: Re-released for DXP Platform.; Publisher: Altium Limited
D41 = ESDA6V1BC6: 4-line ESD protection; Manuf_1: STM; Manuf_Part_1: ESDA5V3L; Ref St: 9179034; Provided: ST; ECCN_US/EU: EAR99/NEC; Distrib: ST; Order: ESDA5V3L; Ordered by: STM
LD43 = LED2: as LD41 on sheet DCI_MCU_144; Published: 8-Jun-2000; Revision: July-2002: Re-released for DXP Platform.; Publisher: Altium Limited
R56 R58-R61 = res1: Resistor; Value: 1K; Published: 8-Jun-2000; Revision: July-2002: Re-released for DXP Platform.; Publisher: Altium Limited
R57 = Resistor_ST: Resistor 0402 / 0603 / 0805; Value: 10K
T41 = NPN: NPN Bipolar Transistor; Code - JEDEC: TO-226-AA; Published: 8-Jun-2000; Revision: July-2002: Re-released for DXP Platform.; Publisher: Altium Limited

## Sheet DCI_TCAN.SchDoc
size 420 x 297 mm; ENG_APP_DATE: --/--/--; DSN_APP_DATE: --/--/--; CHK_APP_DATE: --/--/--
Used 2 times, as channels U_DCI_TCAN_2, U_DCI_TCAN_1. Parts and nets are listed once, with the designators drawn on the sheet.
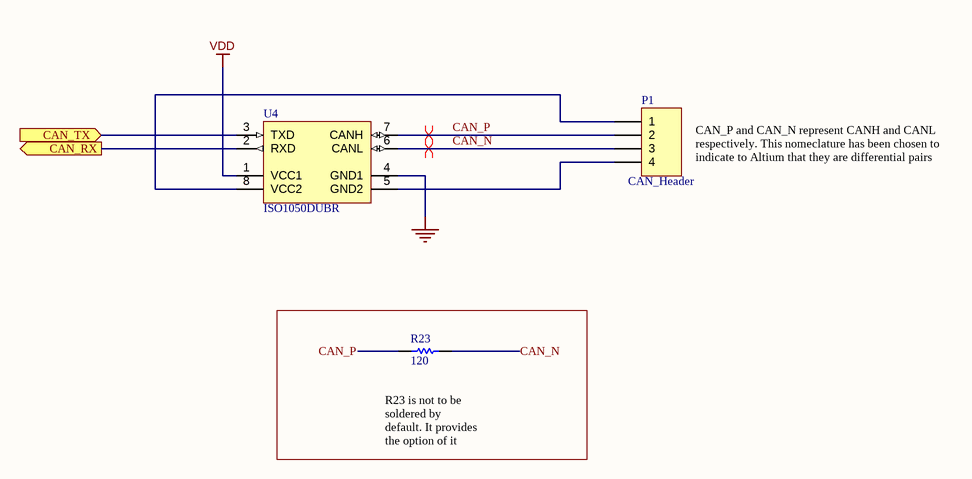
[diagram p4: DCI_TCAN.SchDoc]

### Parts
P1  CAN_Header  [HDR1X4]
R23  120  [0603R]
U4  ISO1050DUBR  [DUB0008A_L]

### Ports
CAN_RX (out), CAN_TX (in)

### Nets
GND: U4.4(GND1)
VDD: U4.1(VCC1)
CAN_N: P1.3 R23.1 U4.6(CANL)
CAN_P: P1.2 R23.2 U4.7(CANH)
CAN_RX: U4.2(RXD) ; port CAN_RX
CAN_TX: U4.3(TXD) ; port CAN_TX
NetP1_1: P1.1 U4.8(VCC2)
NetP1_4: P1.4 U4.5(GND2)

### Channels
U_DCI_TCAN_2: designators end in _U_DCI_TCAN_2; ports CAN_RX=PD2 CAN_TX=PC12
U_DCI_TCAN_1: designators end in _U_DCI_TCAN_1; ports CAN_RX=PF6 CAN_TX=PF7

### Layout directives
differential pair: CAN_N_U_DCI_TCAN_2, CAN_P_U_DCI_TCAN_2

### Notes on the sheet
- CAN_P and CAN_N represent CANH and CANL respectively. This nomeclature has been chosen to indicate to Altium that they are differential pairs
- (near R23) R23 is not to be soldered by default. It provides the option of it being present to the final user. Therefore, only the footprint will be present in the final assembly
- MEMBERS:
- Universitat Politècnica de València
- - Gianmarco Leopoldo Sangoi
- - Vicente Beltrán Morte
- PROJECT:
- SIZE:
- FILE NAME:
- A3
- NUMBER:
- 5
- REVISION:
- A1
- DATE:
- 07/05/2022
- SHEET
- OF
- 7

### Library data of the parts
P1 = Header 4: Header, 4-Pin; LatestRevisionDate: 17-Jul-2002; LatestRevisionNote: Re-released for DXP Platform.; Publisher: Altium Limited
R23 = Res1: Resistor; Value: 1K; Ordered by: Subcon; Published: 8-Jun-2000; Revision: July-2002: Re-released for DXP Platform.; Publisher: Altium Limited
U4 = CMP-0315-00093-2: Isolated CAN Transceiver, -55 to 105 degC, 8-pin SOP (DUB), Green (RoHS & no Sb/Br); Manufacturer: Texas Instruments; Rating: Catalog; Isolated: Yes; Drivers Per Package: 1; PackageReference: DUB0008A; PartNumber: ISO1050DUBR; ComponentLink2Description: Package Specification; ComponentLink1Description: Datasheet; Mounting Technology: Surface Mount; ComponentLink1URL: http://www.ti.com/general/docs/lit/getliterature.tsp?genericPartNumber=ISO1050&fileType=pdf; ComponentLink2URL: http://www.ti.com/litv/pdf/mpds247b; Eco-Plan: Green (RoHS & no Sb/Br); PackageDescription: 8-Pin Small Outline Package 2.54 mm Pitch; PackageVersion: revC, May-2006; SubFamily: CAN; DatasheetVersion: SLLS983E

## Sheet DC1_ADC_Conditioning.SchDoc
size 420 x 297 mm; ENG_APP_DATE: --/--/--; DSN_APP_DATE: --/--/--; CHK_APP_DATE: --/--/--
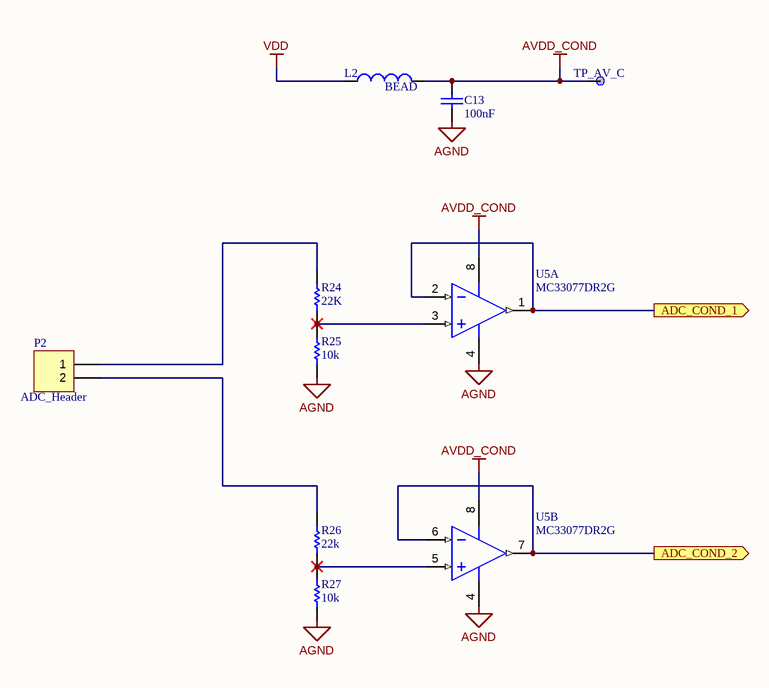
[diagram p5: DC1_ADC_Conditioning.SchDoc]

### Parts
C13  100nF  [0603C]
L2  BEAD  [0603L]
P2  ADC_Header  [HDR1X2]
R24  22K  [0603R]
R25  10k  [0603R]
R26  22k  [0603R]
R27  10k  [0603R]
TP_AV_C  TP_AVDD_C  [TP]  (value not drawn)
U5  MC33077DR2G  [ONSC-SOIC-8-751-07_V]  (parts A,B of 2)

### Ports
ADC_COND_1 (out), ADC_COND_2 (out)

### Nets
AGND: C13.2 R25.1 R27.1 U5.4(VEE)
AVDD_COND: C13.1 L2.2 TP_AV_C.1 U5.8(VCC)
VDD: L2.1
PF4: U5.1(OUT1) U5.2(IN1-) ; port ADC_COND_1
PF5: U5.6(IN2-) U5.7(OUT2) ; port ADC_COND_2
NetP2_1: P2.1 R24.2
NetP2_2: P2.2 R26.2
NetR24_1: R24.1 R25.2 U5.3(IN1+)
NetR26_1: R26.1 R27.2 U5.5(IN2+)

### Notes on the sheet
- MEMBERS:
- Universitat Politècnica de València
- - Gianmarco Leopoldo Sangoi
- - Vicente Beltrán Morte
- PROJECT:
- SIZE:
- FILE NAME:
- A3
- NUMBER:
- 6
- REVISION:
- A1
- DATE:
- 07/05/2022
- SHEET
- OF
- 7

### Library data of the parts
C13 = Cap: Capacitor; Value: 10nF; Published: 8-Jun-2000; Revision: July-2002: Re-released for DXP Platform.; Publisher: Altium Limited
L2 = Inductor: Value: 100uH; Published: 8-Jun-2000; Revision: July-2002: Re-released for DXP Platform.; Publisher: Altium Limited
P2 = Header 2: Header, 2-Pin; LatestRevisionDate: 17-Jul-2002; LatestRevisionNote: Re-released for DXP Platform.; Publisher: Altium Limited
R24-R27 = Res1: Resistor; Value: 1K; Ordered by: Subcon; Published: 8-Jun-2000; Revision: July-2002: Re-released for DXP Platform.; Publisher: Altium Limited
TP_AV_C = TP
U5 = CMP-1310-00366-1: Low Noise Dual Operational Amplifier, 5 to 36 V, -40 to 85 degC, 8-Pin SOIC, Pb-Free, Tape and Reel; Manufacturer: On Semiconductor; GBW Typ (MHz): 37; SR Typ (V/uS): 11; VCC Max (V): 36; VCC Min (V): 5; ComponentLink2Description: Datasheet; RoHS: TRUE; PackageReference: SOIC-8-751-07; DatasheetVersion: Rev. 5; Packing: Tape and Reel; PackageDescription: 8-Pin Small Outline Integrated Circuit, Body 4.9 x 3.9 mm, Pitch 1.27 mm; ComponentLink3URL: http://www.onsemi.com/pub_link/Collateral/751-07.PDF; ComponentLink3Description: Package Specification; Mounting Technology: Surface Mount; ComponentLink2URL: http://www.onsemi.cn/pub_link/Collateral/MC33077-D.PDF; ComponentLink1Description: Manufacturer URL; PackageVersion: Rev. AK, 02/2011; PartNumber: MC33077DR2G; ComponentLink1URL: http://www.onsemi.com/

## Sheet DCI_MCU_Power.SchDoc
size 420 x 297 mm; ENG_APP_DATE: --/--/--; DSN_APP_DATE: --/--/--; CHK_APP_DATE: --/--/--
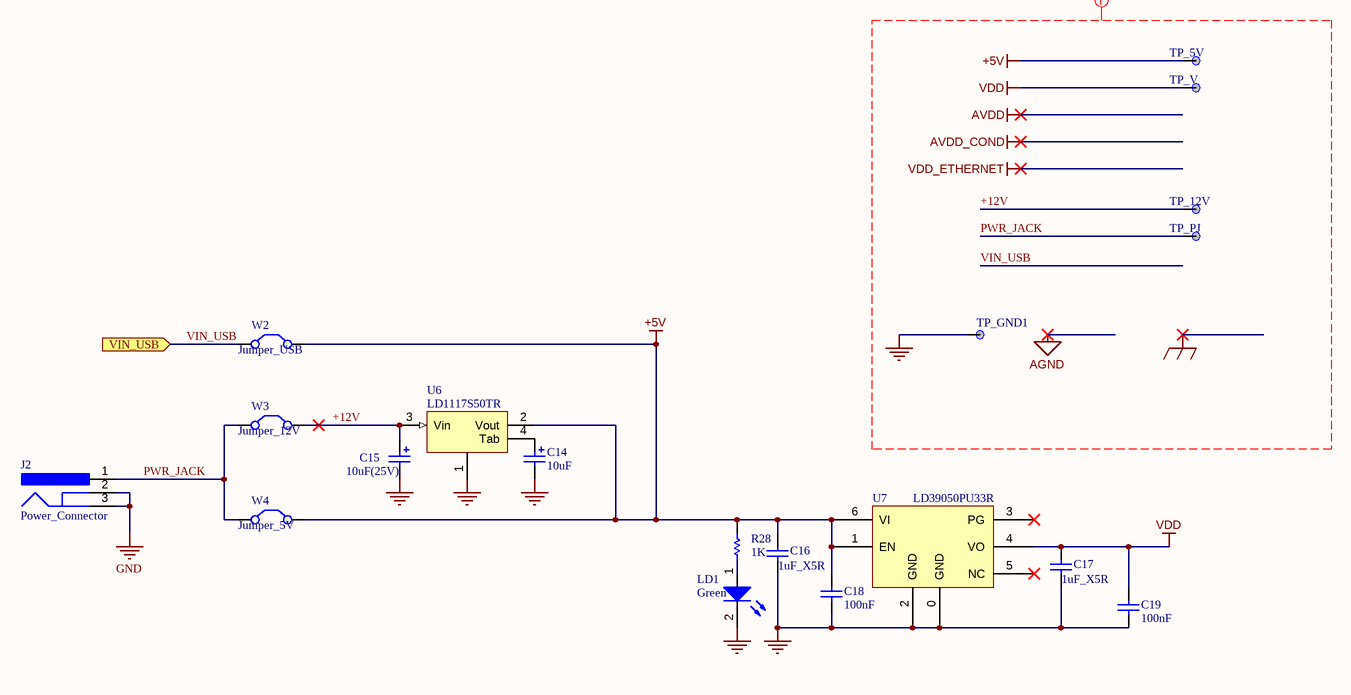
[diagram p6: DCI_MCU_Power.SchDoc]

### Parts
C14  10uF  [TAN-A - XDown]
C15  10uF(25V)  [TAN-B]
C16  1uF_X5R  [0603C]
C17  1uF_X5R  [0603C]
C18  100nF  [0603C]
C19  100nF  [0603C]
J2  Power_Connector  [CUI-PJ-002AH-4_V]
LD1  Green  [0603D-G]
R28  1K  [0603R]
TP_5V  TP_5V  [TP]  (value not drawn)
TP_12V  TP_12V  [TP]  (value not drawn)
TP_GND1  TP_GND  [TP]  (value not drawn)
TP_PJ  TP_PJ  [TP]  (value not drawn)
TP_V  TP_VDD  [TP]  (value not drawn)
U6  LD1117S50TR  [SOT-223]
U7  LD39050PU33R  [DFN6_0R95_3x3_TP]
W2  Jumper_USB  [RAD-0.2]
W3  Jumper_12V  [RAD-0.2]
W4  Jumper_5V  [RAD-0.2]

### Ports
VIN_USB (in)

### Nets
+5V: C16.1 C18.2 R28.2 TP_5V.1 U6.2(Vout) U7.1(EN) U7.6(VI) W2.2(C2) W4.2(C2)
GND: C14.2 C15.2 C16.2 C17.2 C18.1 C19.1 J2.2 J2.3 LD1.2(K) TP_GND1.1 U6.1 U7.0(GND) U7.2(GND)
VDD: C17.1 C19.2 TP_V.1 U7.4(VO)
+12V: C15.1 TP_12V.1 U6.3(Vin) W3.2(C2)
PWR_JACK: J2.1 TP_PJ.1 W3.1(C1) W4.1(C1)
VIN_USB: W2.1(C1) ; port VIN_USB
NetC14_1: C14.1 U6.4(Tab)
NetLD1_1: LD1.1(A) R28.1

Not connected (* = marked no-connect by the designer): U7 3(PG)* 5(NC)*

### Layout directives
net class PWR: +5V, +12V, AGND, AVDD, AVDD_COND, EGND, GND, PWR_JACK, VDD, VDD_ETHERNET, VIN_USB

### Notes on the sheet
- MEMBERS:
- Universitat Politècnica de València
- - Gianmarco Leopoldo Sangoi
- - Vicente Beltrán Morte
- PROJECT:
- SIZE:
- FILE NAME:
- A3
- NUMBER:
- 7
- REVISION:
- A1
- DATE:
- 07/05/2022
- SHEET
- OF

### Library data of the parts
C14 C15 = Cap Pol1: Polarized Capacitor (Radial); Published: 8-Jun-2000; Revision: July-2002: Re-released for DXP Platform.; Publisher: Altium Limited; Value: 10uF
C16 C17 = CAP SMD 0603  X5R 1µF 25V 10%: as C5 on sheet DCI_Ethernet; Manufacturer: *; Manufacturer P/N: *; Order code Farnell: 1288202RL; Value: 1µF; Power: *; Technology: X5R; Temperature  Factor: *; Temperature Max: +125°C; Temperature Min: -55°C; STS Code: *
C18 C19 = Capacitor_ST: Capacitor 0402 / 0603 / 0805; Revision: July-2002: Re-released for DXP Platform.; Value: 100nF
J2 = CMP-2000-06896-1: DC Power Jack, Right Angle, -25 to 85 degC, 4-Pin 14.8 x 9 x 11 mm SMD, RoHS, Tape and Reel; Manufacturer: CUIInc.; PartNumber: PJ-002AH; Current Rating: 5A; Voltage Rating: 24V; Outside Contact Diameter: 6.5mm; Inside Contact Diameter: 2mm; Insulation Resistance: 100MOhms; Brand: CUI; Contact Plating: Nickel; Contact Gender: Male; Datasheet URL: http://www.cui.com/product/resource/pj-002ah-smt.pdf; Mounting Style: SMD/SMT; Mounting Technology: SurfaceMount; Operating Temperature Range: -25Cto+85C; Flammability Rating: UL94V-0; Mounting Angle: Right; Packaging: Reel; Connector Type: DCPowerJack; Product Category: DCPowerConnectors; Package Description: 4-Pin Surface Mount Device, Body 14.8 x 9 mm, Pitch 6.1 mm; Factory Pack Quantity: 350; Datasheet Version: Rev. 1.03, 11/2012; Contact Material: Brass; Package Reference: PJ-002AH; Housing Material: Polyamide(PA); Manufacturer URL: http://www.cui.com/; Product: Jacks; RoHS: True; Termination Style: SMD/SMT
LD1 = LED2: as LD41 on sheet DCI_MCU_144; Published: 8-Jun-2000; Revision: July-2002: Re-released for DXP Platform.; Publisher: Altium Limited
R28 = Resistor_ST: Resistor 0402 / 0603 / 0805; Value: 10K
TP_5V TP_12V TP_GND1 TP_PJ TP_V = TP
U6 = LD1117
U7 = LD39050P
W2-W4 = Jumper: Jumper Wire; Published: 24-Mar-1999; LatestRevisionDate: 17-Jul-2002; LatestRevisionNote: Re-released for DXP Platform.; PackageReference: RAD-0.2; Publisher: Altium Limited; PackageDescription: Radial Cap, Thru-Hole; 2 Leads; 0.2 in Pin Spacing

## Nets that join several sheets
AGND: DCI_MCU_144 (5 pins), DC1_ADC_Conditioning (C13.2 R25.1 R27.1 U5.4)
GND: DCI_Ethernet (20 pins), DCI_MCU_144 (47 pins), DCI_USB (14 pins), U_DCI_TCAN_2 (U4_U_DCI_TCAN_2.4), DCI_MCU_Power (13 pins), U_DCI_TCAN_1 (U4_U_DCI_TCAN_1.4)
SHIELD: DCI_Ethernet (6 pins), DCI_USB (5 pins)
VDD: DCI_Ethernet (8 pins), DCI_MCU_144 (42 pins), DCI_USB (R59.2), U_DCI_TCAN_2 (U4_U_DCI_TCAN_2.1), DC1_ADC_Conditioning (L2.1), DCI_MCU_Power (C17.1 C19.2 TP_V.1 U7.4), U_DCI_TCAN_1 (U4_U_DCI_TCAN_1.1)
NRST: DCI_Ethernet (U3.15), DCI_MCU_144 (5 pins)
PA1: DCI_Ethernet (R19.2), DCI_MCU_144 (U42.35)
PA2: DCI_Ethernet (R17.1 U3.12), DCI_MCU_144 (U42.36)
PA7: DCI_Ethernet (R16.2), DCI_MCU_144 (U42.43)
PA10: DCI_MCU_144 (U42.102), DCI_USB (CN42.4 D41.1)
PB13: DCI_Ethernet (U3.18), DCI_MCU_144 (U42.74)
PC1: DCI_Ethernet (U3.13), DCI_MCU_144 (U42.27)
PC4: DCI_Ethernet (R8.2), DCI_MCU_144 (U42.44)
PC5: DCI_Ethernet (R9.2), DCI_MCU_144 (U42.45)
PC12: DCI_MCU_144 (U42.113), U_DCI_TCAN_2 (U4_U_DCI_TCAN_2.3)
PD2: DCI_MCU_144 (U42.116), U_DCI_TCAN_2 (U4_U_DCI_TCAN_2.2)
PF4: DCI_MCU_144 (U42.14), DC1_ADC_Conditioning (U5.1 U5.2)
PF5: DCI_MCU_144 (U42.15), DC1_ADC_Conditioning (U5.6 U5.7)
PF6: DCI_MCU_144 (U42.18), U_DCI_TCAN_1 (U4_U_DCI_TCAN_1.2)
PF7: DCI_MCU_144 (U42.19), U_DCI_TCAN_1 (U4_U_DCI_TCAN_1.3)
PG6: DCI_MCU_144 (U42.91), DCI_USB (R57.2)
PG7: DCI_MCU_144 (U42.92), DCI_USB (R56.2 R58.1)
PG11: DCI_Ethernet (U3.16), DCI_MCU_144 (U42.126)
PG13: DCI_Ethernet (U3.17), DCI_MCU_144 (U42.128)
USB_D_N: DCI_MCU_144 (U42.103), DCI_USB (CN42.2 D41.4)
USB_D_P: DCI_MCU_144 (U42.104), DCI_USB (CN42.3 D41.3 R57.1)
VIN_USB: DCI_MCU_144 (R43.1), DCI_USB (12 pins), DCI_MCU_Power (W2.1)